# Altium schematic sheet HIP9011.SchDoc
size A4; Organization: Altium Limited; Address1: L3, 12a Rodborough Rd; Address2: Frenchs Forest; Address3: NSW; Address4: Australia 2086
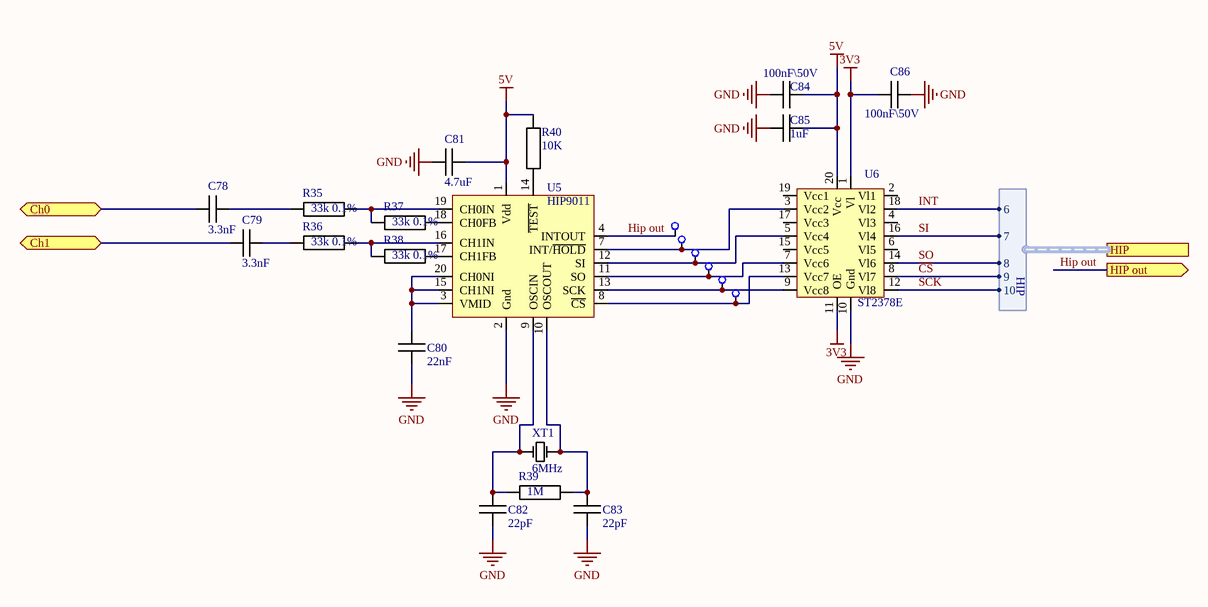
[diagram p0: HIP9011.SchDoc]

## Parts
C78  3.3nF  [SMD 0603]
C79  3.3nF  [SMD 0603]
C80  22nF  [SMD 0603]
C81  4.7uF  [SMD 0603]
C82  22pF  [SMD 0603]
C83  22pF  [SMD 0603]
C84  100nF\50V  [SMD 0603]
C85  1uF  [SMD 0603]
C86  100nF\50V  [SMD 0603]
R35  33k 0.1%  [SMD 0603]
R36  33k 0.1%  [SMD 0603]
R37  33k 0.1%  [SMD 0603]
R38  33k 0.1%  [SMD 0603]
R39  1M  [SMD 0603]
R40  10K  [SMD 0603]
TP53  TestPoint  [TESTPOINT]  (value not drawn)
TP54  TestPoint  [TESTPOINT]  (value not drawn)
TP55  TestPoint  [TESTPOINT]  (value not drawn)
TP56  TestPoint  [TESTPOINT]  (value not drawn)
TP57  TestPoint  [TESTPOINT]  (value not drawn)
TP58  TestPoint  [TESTPOINT]  (value not drawn)
U5  HIP9011  [SOIC20]
U6  ST2378E  [TSSOP20]
XT1  6MHz  [KX-13]

## Ports
Ch0 (bidir), Ch1 (bidir), HIP (harness HIP), HIP out (out)

## Harnesses
HIP: 6, 7, 8, 9, 10

## Nets
3V3: C86.1 U6.1(Vl) U6.11(OE)
5V: C81.2 C84.1 C85.1 R40.1 U5.1(Vdd) U6.20(Vcc)
GND: C80.1 C81.1 C82.1 C83.1 C84.2 C85.2 C86.2 U5.2(Gnd) U6.10(Gnd) XT1.3
~{CS}: U6.8(Vl7) ; port HIP.9
Ch0: C78.2 ; port Ch0
Ch1: C79.2 ; port Ch1
Hip out: TP53.0 U5.4(INTOUT) ; port HIP out
INT: U6.18(Vl2) ; port HIP.6
SCK: U6.12(Vl8) ; port HIP.10
SI: U6.16(Vl4) ; port HIP.7
SO: U6.14(Vl6) ; port HIP.8
NetC78_1: C78.1 R35.1
NetC79_1: C79.1 R36.1
NetC80_2: C80.2 U5.3(VMID) U5.15(CH1NI) U5.20(CH0NI)
NetC82_2: C82.2 R39.1 U5.9(OSCIN) XT1.1
NetC83_2: C83.2 R39.2 U5.10(OSCOUT) XT1.2
NetR35_2: R35.2 R37.1 U5.19(CH0IN)
NetR36_2: R36.2 R38.1 U5.16(CH1IN)
NetR37_2: R37.2 U5.18(CH0FB)
NetR38_2: R38.2 U5.17(CH1FB)
NetR40_2: R40.2 U5.14(~{TEST})
NetTP54_0: TP54.0 U5.7(INT/~{HOLD}) U6.3(Vcc2)
NetTP55_0: TP55.0 U5.12(SI) U6.5(Vcc4)
NetTP56_0: TP56.0 U5.11(SO) U6.7(Vcc6)
NetTP57_0: TP57.0 U5.13(SCK) U6.9(Vcc8)
NetTP58_0: TP58.0 U5.8(~{CS}) U6.13(Vcc7)

Not connected (* = marked no-connect by the designer): U6 2(Vl1) 4(Vl3) 6(Vl5) 15(Vcc5) 17(Vcc3) 19(Vcc1)

## Notes on the sheet
- Title
- Size:
- Date:
- A4
- Number:
- Time:
- Revision:
- Sheet
- of
- File:

## Library data of the parts
C78 C79 = Capasitor: CC0603KRX7R9BB332; Value: 3.3nF
C80 = Capasitor: CC0603KRX7R9BB223; Value: 22nF
C81 = Capasitor: CC0603KRX5R6BB475; Value: 4.7uF
C82 C83 = Capasitor: CC0603JRNPO9BN220; Value: 22pF
C84 C86 = Capasitor: CC0603KRX7R9BB104; Value: 100nF\50V
C85 = Capasitor: CL10A105KB8NNNC; Value: 1uF
R35-R38 = Resistor: RT0603BRD0733KL; Value: 33k 0.1%
R39 = Resistor: RC0603FR-071ML; Value: 1M
R40 = Resistor: RC0603FR-0710KL; Value: 10K
U5 = HIP9011: Engine Knock Signal Processor
U6 = ST2378E: 8-bit dual supply 1.71 to 5.5 V level translator with I/O VCC ± 15 KV / ESD protection
XT1 = xtall: KX-13 6.0 MHz / Geyer